# Altium schematic sheet ADC&DAC.SchDoc
size A4
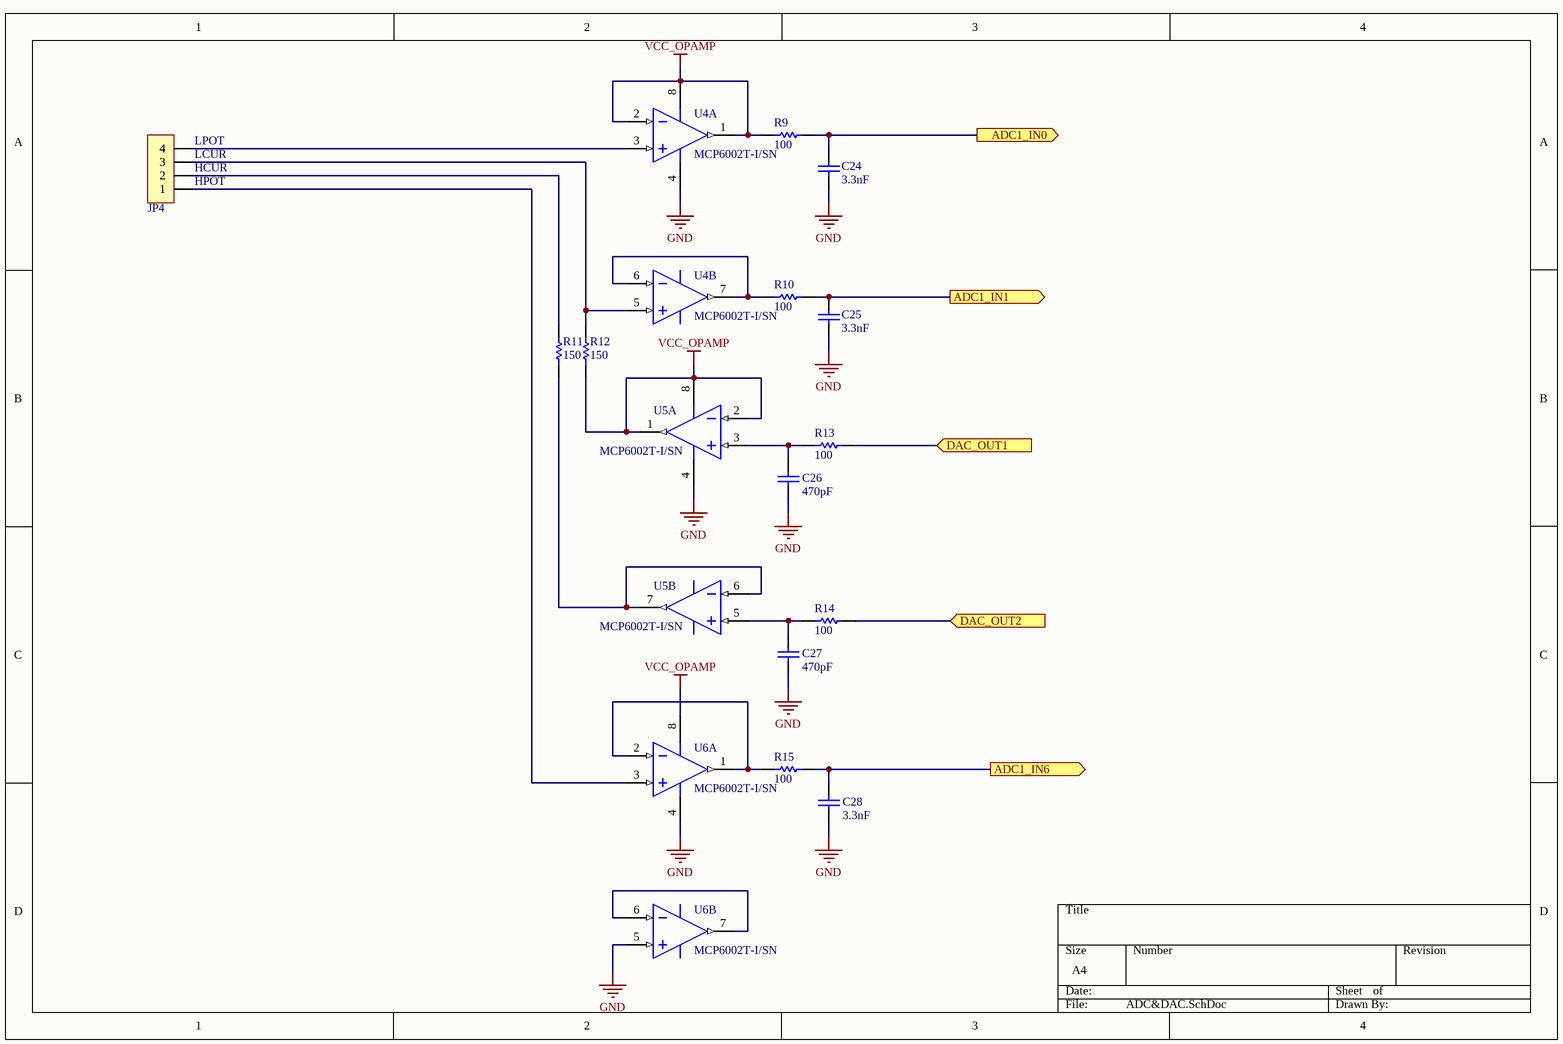
[diagram p0: ADC&DAC.SchDoc]

## Parts
C24  value 3.3nF  [new_0805]  (hidden comment: Cap)
C25  value 3.3nF  [new_0805]  (hidden comment: Cap)
C26  value 470pF  [new_0805]  (hidden comment: Cap)
C27  value 470pF  [new_0805]  (hidden comment: Cap)
C28  value 3.3nF  [new_0805]  (hidden comment: Cap)
JP4  HDR-1X4  [XH2.54-WI-4P]  (value not drawn)
R9  value 100  [new_0805]  (hidden comment: Res1)
R10  value 100  [new_0805]  (hidden comment: Res1)
R11  value 150  [new_0805]  (hidden comment: Res1)
R12  value 150  [new_0805]  (hidden comment: Res1)
R13  value 100  [new_0805]  (hidden comment: Res1)
R14  value 100  [new_0805]  (hidden comment: Res1)
R15  value 100  [new_0805]  (hidden comment: Res1)
U4  MCP6002T-I/SN  [SOIC-SN8_N]  (parts A,B of 2)
U5  MCP6002T-I/SN  [SOIC-SN8_N]  (parts A,B of 2)
U6  MCP6002T-I/SN  [SOIC-SN8_N]  (parts A,B of 2)

## Ports
ADC1_IN0 (out), ADC1_IN1 (out), ADC1_IN6 (out), DAC_OUT1 (in), DAC_OUT2 (in)

## Nets
GND: C24.2 C25.2 C26.1 C27.1 C28.1 U4.4(VSS) U5.4(VSS) U6.4(VSS) U6.5(VINB+)
VCC_OPAMP: R9.1 R12.1 U4.1(VOUTA) U4.2(VINA-) U4.8(VDD) U5.1(VOUTA) U5.2(VINA-) U5.8(VDD) U6.8(VDD)
ADC1_IN0: C24.1 R9.2 ; port ADC1_IN0
ADC1_IN1: C25.1 R10.2 ; port ADC1_IN1
ADC1_IN6: C28.2 R15.2 ; port ADC1_IN6
DAC_OUT1: R13.2 ; port DAC_OUT1
DAC_OUT2: R14.2 ; port DAC_OUT2
NetC26_2: C26.2 R13.1 U5.3(VINA+)
NetC27_2: C27.2 R14.1 U5.5(VINB+)
NetJP4_1: JP4.1 U6.3(VINA+)
NetJP4_2: JP4.2 R11.2
NetJP4_3: JP4.3 R12.2 U4.5(VINB+)
NetJP4_4: JP4.4 U4.3(VINA+)
NetR10_1: R10.1 U4.6(VINB-) U4.7(VOUTB)
NetR11_1: R11.1 U5.6(VINB-) U5.7(VOUTB)
NetR15_1: R15.1 U6.1(VOUTA) U6.2(VINA-)
NetU6_6: U6.6(VINB-) U6.7(VOUTB)

## Notes on the sheet
- (near JP4) HPOT
- (near JP4) HCUR
- (near JP4) LCUR
- (near JP4) LPOT

## Library data of the parts
C24-C28 = Cap: Capacitor; Published: 8-Jun-2000; LatestRevisionDate: 17-Jul-2002; LatestRevisionNote: Re-released for DXP Platform.; PackageReference: RAD-0.3; Publisher: Altium Limited; PackageDescription: Radial Cap, Thru-Hole; 2 Leads; 0.3 in Pin Spacing
JP4 = Header 4: 4P接插件; 版权归属: 封装库来自淘宝 ID：黄晶宝石; BOM名称: 4P接插件; 学习资源: https://shop463601444.taobao.com
R9-R15 = Res1: Resistor; Published: 8-Jun-2000; LatestRevisionDate: 17-Jul-2002; LatestRevisionNote: Re-released for DXP Platform.; PackageReference: AXIAL-0.3; Publisher: Altium Limited; PackageDescription: Axial Device, Thru-Hole; 2 Leads; 0.3 in Pin Spacing
U4-U6 = MCP6002T-I/SN: 1 MHz, Low-Power Operational Amplifier, 8-Pin SOIC, Industrial Temperature, Tape and Reel; Manufacturer: Microchip; DatasheetVersion: revJ, Nov-2009; PackageVersion: revBB, Aug-2009; PackageReference: SOIC-SN8; PackageDescription: 8-Lead Plastic Small Outline (SN) - Narrow, 3.90mm Body [SOIC]; Supplier 1: Digi-Key; Supplier Part Number 1: MCP6002T-I/SN-ND; Supplier 2: Newark; Supplier Part Number 2: 72C4274; Supplier 3: Mouser; Supplier Part Number 3: 579-MCP6002T-I/SN; Mounting Technology: Surface Mount; Code_JEDEC: MS-012; Code_IPC: SOIC127P600-8; PartNumber: MCP6002T-I/SN; ComponentLink1Description: Manufacturer URL; ComponentLink1URL: http://www.microchip.com/; ComponentLink2Description: Datasheet; ComponentLink2URL: http://ww1.microchip.com/downloads/en/DeviceDoc/21733j.pdf; ComponentLink3Description: Package Specification; ComponentLink3URL: http://www.microchip.com/stellent/groups/techpub_sg/documents/packagingspec/en012702.pdf